# Altium schematic sheet CONNECT2.SchDoc
size A4
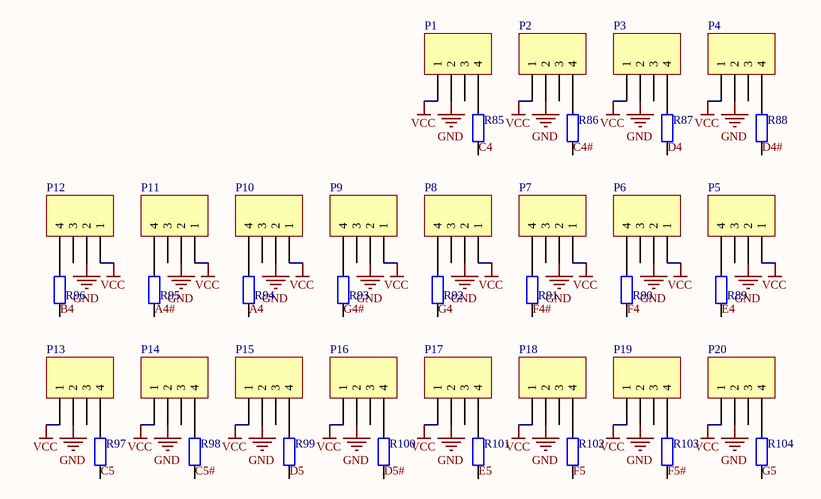
[diagram p0: CONNECT2.SchDoc]

## Parts
P1  Header 4  [FPC1.0-2H-WS-4P]  (value not drawn)
P2  Header 4  [FPC1.0-2H-WS-4P]  (value not drawn)
P3  Header 4  [FPC1.0-2H-WS-4P]  (value not drawn)
P4  Header 4  [FPC1.0-2H-WS-4P]  (value not drawn)
P5  Header 4  [FPC1.0-2H-WS-4P]  (value not drawn)
P6  Header 4  [FPC1.0-2H-WS-4P]  (value not drawn)
P7  Header 4  [FPC1.0-2H-WS-4P]  (value not drawn)
P8  Header 4  [FPC1.0-2H-WS-4P]  (value not drawn)
P9  Header 4  [FPC1.0-2H-WS-4P]  (value not drawn)
P10  Header 4  [FPC1.0-2H-WS-4P]  (value not drawn)
P11  Header 4  [FPC1.0-2H-WS-4P]  (value not drawn)
P12  Header 4  [FPC1.0-2H-WS-4P]  (value not drawn)
P13  Header 4  [FPC1.0-2H-WS-4P]  (value not drawn)
P14  Header 4  [FPC1.0-2H-WS-4P]  (value not drawn)
P15  Header 4  [FPC1.0-2H-WS-4P]  (value not drawn)
P16  Header 4  [FPC1.0-2H-WS-4P]  (value not drawn)
P17  Header 4  [FPC1.0-2H-WS-4P]  (value not drawn)
P18  Header 4  [FPC1.0-2H-WS-4P]  (value not drawn)
P19  Header 4  [FPC1.0-2H-WS-4P]  (value not drawn)
P20  Header 4  [FPC1.0-2H-WS-4P]  (value not drawn)
R85  1KΩ (1001) ±1%  [0603_R]  (value not drawn)
R86  1KΩ (1001) ±1%  [0603_R]  (value not drawn)
R87  1KΩ (1001) ±1%  [0603_R]  (value not drawn)
R88  1KΩ (1001) ±1%  [0603_R]  (value not drawn)
R89  1KΩ (1001) ±1%  [0603_R]  (value not drawn)
R90  1KΩ (1001) ±1%  [0603_R]  (value not drawn)
R91  1KΩ (1001) ±1%  [0603_R]  (value not drawn)
R92  1KΩ (1001) ±1%  [0603_R]  (value not drawn)
R93  1KΩ (1001) ±1%  [0603_R]  (value not drawn)
R94  1KΩ (1001) ±1%  [0603_R]  (value not drawn)
R95  1KΩ (1001) ±1%  [0603_R]  (value not drawn)
R96  1KΩ (1001) ±1%  [0603_R]  (value not drawn)
R97  1KΩ (1001) ±1%  [0603_R]  (value not drawn)
R98  1KΩ (1001) ±1%  [0603_R]  (value not drawn)
R99  1KΩ (1001) ±1%  [0603_R]  (value not drawn)
R100  1KΩ (1001) ±1%  [0603_R]  (value not drawn)
R101  1KΩ (1001) ±1%  [0603_R]  (value not drawn)
R102  1KΩ (1001) ±1%  [0603_R]  (value not drawn)
R103  1KΩ (1001) ±1%  [0603_R]  (value not drawn)
R104  1KΩ (1001) ±1%  [0603_R]  (value not drawn)

## Nets
GND: P1.2 P2.2 P3.2 P4.2 P5.2 P6.2 P7.2 P8.2 P9.2 P10.2 P11.2 P12.2 P13.2 P14.2 P15.2 P16.2 P17.2 P18.2 P19.2 P20.2
VCC: P1.1 P2.1 P3.1 P4.1 P5.1 P6.1 P7.1 P8.1 P9.1 P10.1 P11.1 P12.1 P13.1 P14.1 P15.1 P16.1 P17.1 P18.1 P19.1 P20.1
A4: R94.1
A4#: R95.1
B4: R96.1
C4: R85.1
C4#: R86.1
C5: R97.1
C5#: R98.1
D4: R87.1
D4#: R88.1
D5: R99.1
D5#: R100.1
E4: R89.1
E5: R101.1
F4: R90.1
F4#: R91.1
F5: R102.1
F5#: R103.1
G4: R92.1
G4#: R93.1
G5: R104.1
NetP1_4: P1.4 R85.2
NetP2_4: P2.4 R86.2
NetP3_4: P3.4 R87.2
NetP4_4: P4.4 R88.2
NetP5_4: P5.4 R89.2
NetP6_4: P6.4 R90.2
NetP7_4: P7.4 R91.2
NetP8_4: P8.4 R92.2
NetP9_4: P9.4 R93.2
NetP10_4: P10.4 R94.2
NetP11_4: P11.4 R95.2
NetP12_4: P12.4 R96.2
NetP13_4: P13.4 R97.2
NetP14_4: P14.4 R98.2
NetP15_4: P15.4 R99.2
NetP16_4: P16.4 R100.2
NetP17_4: P17.4 R101.2
NetP18_4: P18.4 R102.2
NetP19_4: P19.4 R103.2
NetP20_4: P20.4 R104.2

Not connected (* = marked no-connect by the designer): P1 3; P2 3; P3 3; P4 3; P5 3; P6 3; P7 3; P8 3; P9 3; P10 3; P11 3; P12 3; P13 3; P14 3; P15 3; P16 3; P17 3; P18 3; P19 3; P20 3

## Library data of the parts
P1-P20 = Header 4: Header, 4-Pin; LatestRevisionDate: 17-Jul-2002; LatestRevisionNote: Re-released for DXP Platform.; Publisher: Altium Limited
R85-R104 = 0603 1KΩ (1001) 1%: 贴片电阻; ComponentLink1Description: 供应商链接; ComponentLink1URL: http://www.szlcsc.com/product/details_21904.html; Package: 0603; Supplier: LC; SuppliersPartNumber: C21190